# Altium schematic sheet MCU.SchDoc
size A
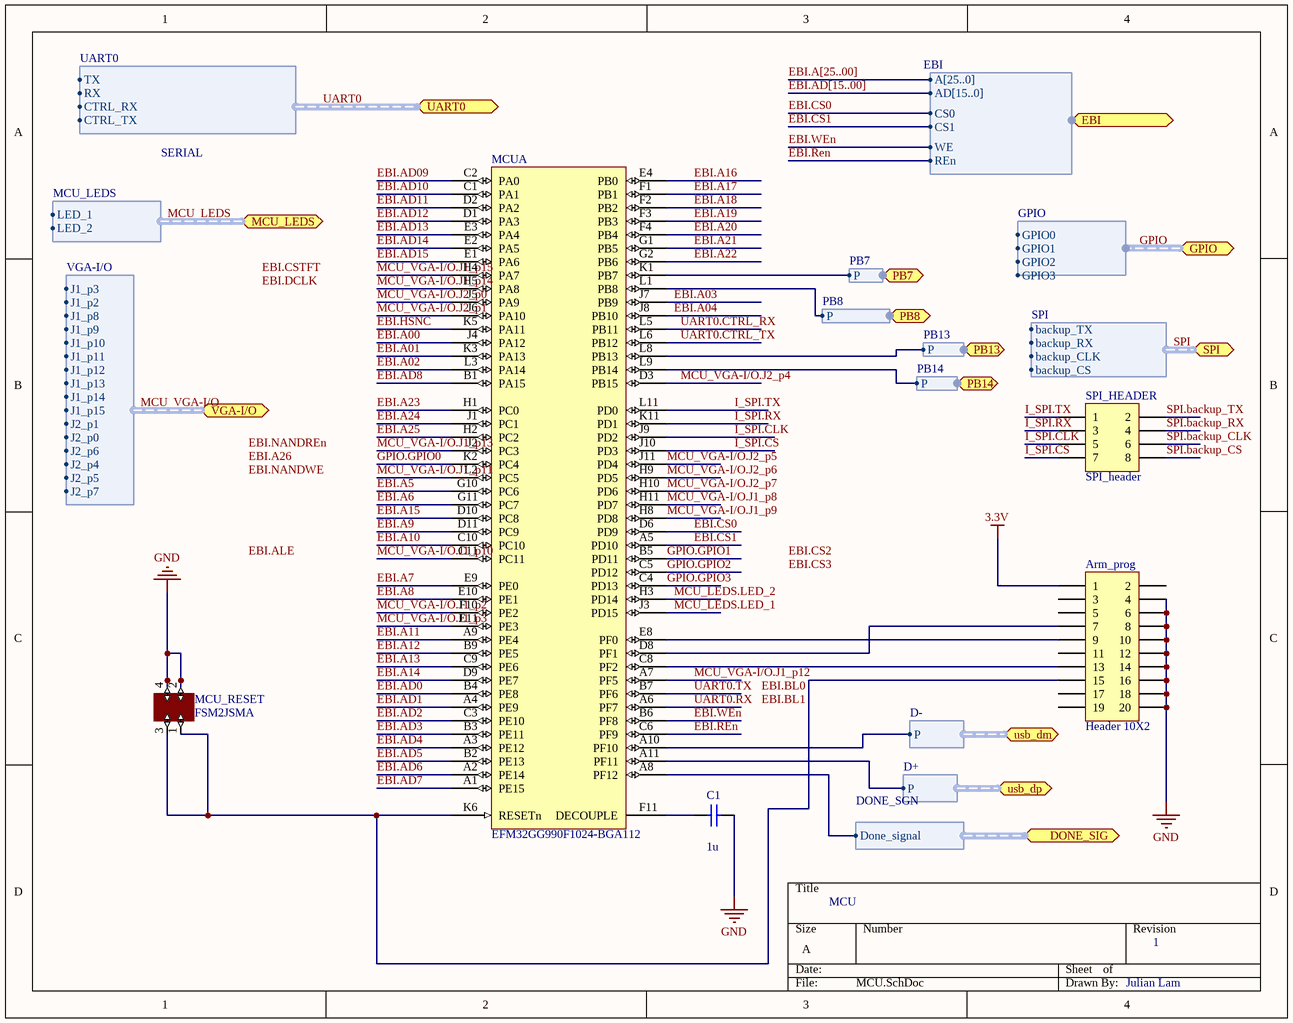
[diagram p0: MCU.SchDoc]

## Parts
Arm_prog  Header 10X2  [HDR2X10]
C1  value 1u  [C1206]
MCU  EFM32GG990F1024-BGA112  [ENMR-BGA112]  (part A of 2)
MCU_RESET  FSM2JSMA  [Button]
SPI_HEADER  SPI_header  [HDR2X4]

## Ports
DONE_SIG (harness DONE_SGN), EBI (harness EBI), GPIO (harness GPIO), MCU_LEDS (harness MCU_LEDS), PB7 (harness PB7), PB8 (harness PB8), PB13 (harness PB13), PB14 (harness PB14), SPI (harness SPI), UART0 (harness UART0), usb_dm (harness D-), usb_dp (harness D+), VGA-I/O (harness VGA-I/O)

## Harnesses
D-: P
D+: P
EBI: AD[15..0], A[25..0], CS0, WE, REn, CS1
PB7: P
PB8: P
PB13: P
PB14: P
SPI: backup_TX, backup_RX, backup_CLK, backup_CS
UART0: TX, RX, CTRL_RX, CTRL_TX
DONE_SGN: Done_signal
MCU_LEDS: LED_1, LED_2
VGA-I/O: J2_p7, J2_p5, J2_p4, J2_p6, J2_p0, J2_p1, J1_p15, J1_p14, J1_p13, J1_p12, J1_p11, J1_p10, J1_p9, J1_p8, J1_p2, J1_p3
GPIO: GPIO0, GPIO1, GPIO2, GPIO3

## Nets
3.3V: Arm_prog.1
GND: Arm_prog.4 Arm_prog.6 Arm_prog.8 Arm_prog.10 Arm_prog.12 Arm_prog.14 Arm_prog.16 Arm_prog.18 Arm_prog.20 C1.2 MCU_RESET.2 MCU_RESET.4
EBI.A00: MCU.J4(PA12)
EBI.A01: MCU.K3(PA13)
EBI.A02: MCU.L3(PA14)
EBI.A03: MCU.J7(PB9)
EBI.A04: MCU.J8(PB10)
EBI.A5: MCU.G10(PC6)
EBI.A6: MCU.G11(PC7)
EBI.A7: MCU.E9(PE0)
EBI.A8: MCU.E10(PE1)
EBI.A9: MCU.D11(PC9)
EBI.A10: MCU.C10(PC10)
EBI.A11: MCU.A9(PE4)
EBI.A12: MCU.B9(PE5)
EBI.A13: MCU.C9(PE6)
EBI.A14: MCU.D9(PE7)
EBI.A15: MCU.D10(PC8)
EBI.A16: MCU.E4(PB0)
EBI.A17: MCU.F1(PB1)
EBI.A18: MCU.F2(PB2)
EBI.A19: MCU.F3(PB3)
EBI.A20: MCU.F4(PB4)
EBI.A21: MCU.G1(PB5)
EBI.A22: MCU.G2(PB6)
EBI.A23: MCU.H1(PC0)
EBI.A24: MCU.J1(PC1)
EBI.A25: MCU.H2(PC2)
EBI.AD0: MCU.B4(PE8)
EBI.AD1: MCU.A4(PE9)
EBI.AD2: MCU.C3(PE10)
EBI.AD3: MCU.B3(PE11)
EBI.AD4: MCU.A3(PE12)
EBI.AD5: MCU.B2(PE13)
EBI.AD6: MCU.A2(PE14)
EBI.AD7: MCU.A1(PE15)
EBI.AD8: MCU.B1(PA15)
EBI.AD09: MCU.C2(PA0)
EBI.AD10: MCU.C1(PA1)
EBI.AD11: MCU.D2(PA2)
EBI.AD12: MCU.D1(PA3)
EBI.AD13: MCU.E3(PA4)
EBI.AD14: MCU.E2(PA5)
EBI.AD15: MCU.E1(PA6)
EBI.CS0: MCU.D6(PD9) ; port EBI.CS0
EBI.CS1: MCU.A5(PD10) ; port EBI.CS1
EBI.HSNC: MCU.K5(PA11)
EBI.REn: MCU.C6(PF9) ; port EBI.REn
EBI.WEn: MCU.B6(PF8) ; port EBI.WE
GPIO.GPIO0: MCU.K2(PC4)
GPIO.GPIO1: MCU.B5(PD11)
GPIO.GPIO2: MCU.C5(PD12)
GPIO.GPIO3: MCU.C4(PD13)
I_SPI.CLK: MCU.J9(PD2) SPI_HEADER.5
I_SPI.CS: MCU.J10(PD3) SPI_HEADER.7
I_SPI.RX: MCU.K11(PD1) SPI_HEADER.3
I_SPI.TX: MCU.L11(PD0) SPI_HEADER.1
MCU_LEDS.LED_1: MCU.J3(PD15)
MCU_LEDS.LED_2: MCU.H3(PD14)
MCU_VGA-I/O.J1_p2: MCU.F10(PE2)
MCU_VGA-I/O.J1_p3: MCU.E11(PE3)
MCU_VGA-I/O.J1_p8: MCU.H11(PD7)
MCU_VGA-I/O.J1_p9: MCU.H8(PD8)
MCU_VGA-I/O.J1_p10: MCU.C11(PC11)
MCU_VGA-I/O.J1_p11: MCU.L2(PC5)
MCU_VGA-I/O.J1_p12: MCU.A7(PF5)
MCU_VGA-I/O.J1_p13: MCU.J2(PC3)
MCU_VGA-I/O.J1_p14: MCU.H5(PA8)
MCU_VGA-I/O.J1_p15: MCU.H4(PA7)
MCU_VGA-I/O.J2_p0: MCU.J5(PA9)
MCU_VGA-I/O.J2_p1: MCU.J6(PA10)
MCU_VGA-I/O.J2_p4: MCU.D3(PB15)
MCU_VGA-I/O.J2_p5: MCU.J11(PD4)
MCU_VGA-I/O.J2_p6: MCU.H9(PD5)
MCU_VGA-I/O.J2_p7: MCU.H10(PD6)
SPI.backup_CLK: SPI_HEADER.6
SPI.backup_CS: SPI_HEADER.8
SPI.backup_RX: SPI_HEADER.4
SPI.backup_TX: SPI_HEADER.2
UART0.CTRL_RX: MCU.L5(PB11)
UART0.CTRL_TX: MCU.L6(PB12)
UART0.RX: MCU.A6(PF7)
UART0.TX: MCU.B7(PF6)
NetArm_prog_7: Arm_prog.7 MCU.D8(PF1)
NetArm_prog_9: Arm_prog.9 MCU.E8(PF0)
NetArm_prog_13: Arm_prog.13 MCU.C8(PF2)
NetArm_prog_15: Arm_prog.15 MCU.K6(RESETn) MCU_RESET.1 MCU_RESET.3
NetC1_1: C1.1 MCU.F11(DECOUPLE)
NetMCU_A8: MCU.A8(PF12) ; port DONE_SIG.Done_signal
NetMCU_A10: MCU.A10(PF10) ; port usb_dm.P
NetMCU_A11: MCU.A11(PF11) ; port usb_dp.P
NetMCU_K1: MCU.K1(PB7) ; port PB7.P
NetMCU_L1: MCU.L1(PB8) ; port PB8.P
NetMCU_L8: MCU.L8(PB13) ; port PB13.P
NetMCU_L9: MCU.L9(PB14) ; port PB14.P

Not connected (* = marked no-connect by the designer): Arm_prog 2 3 5 11 17 19

## Buses and harness runs
bus EBI.A[25..00]
bus EBI.AD[15..00]
harness GPIO = port GPIO
harness MCU_LEDS = port MCU_LEDS
harness MCU_VGA-I/O = port VGA-I/O
harness SPI = port SPI
harness UART0 = port UART0

## Notes on the sheet
- SERIAL
- MCU
- 1
- Julian Lam
- Labels drawn without touching a wire or pin: EBI.A26, EBI.ALE, EBI.BL0, EBI.BL1, EBI.CS2, EBI.CS3, EBI.CSTFT, EBI.DCLK, EBI.NANDREn, EBI.NANDWE

## Library data of the parts
Arm_prog = Header 10X2: Header, 10-Pin, Dual row; LatestRevisionDate: 17-Jul-2002; LatestRevisionNote: Re-released for DXP Platform.; Publisher: Altium Limited
C1 = Cap Semi: Capacitor (Semiconductor SIM Model); Published: 8-Jun-2000; LatestRevisionDate: 29-May-2009; LatestRevisionNote: IPC-7351 Footprint Added.; PackageReference: C1206; Publisher: Altium Limited; PackageDescription: Chip Capacitor
MCU = CMP-0270-00024-1: EFM32 Giant Gecko, M3 ARM Cortex CPU, 1024 KB Flash, 128 KB RAM, 1.85 - 3.8 V Supply, 48 MHz Max Speed, -40 to 85 degC, 112-Pin BGA, RoHS Compliant; LESENSE: Y; RAM (KB): 128; Flash (KB): 1024; LCD: 8x34; OPAMPS: 3; GPIO: 87; Max Speed (MHz): 48; ARM Cortex CPU: M3; DatasheetVersion: Rev 1.00; PartNumber: EFM32GG990F1024-BGA112; ComponentLink3Description: Package Specification; Subcategory: EFM32 Giant Gecko; PackageReference: BGA112; ComponentLink3URL: http://cdn.energymicro.com/dl/devices/pdf/d0007_efm32g290_datasheet.pdf; ComponentLink2Description: Datasheet; USB: Y; PackageDescription: 112-Pin Ball Grid Array, Body 10 x 10 mm, Pitch 0.8 mm; PackageVersion: Rev. 97SPP01315A_X03_06Jun11; ComponentLink1Description: Manufacturer URL; Supply Voltage (V): 1.85 - 3.8; Mounting Technology: Surface Mount; ComponentLink1URL: http://www.energymicro.com/; Generic Part Number: EFM32GG990; ComponentLink2URL: http://cdn.energymicro.com/dl/devices/pdf/d0046_efm32gg990_datasheet.pdf
MCU_RESET = switch-button: Reset button
SPI_HEADER = Header 4X2: Header, 4-Pin, Dual row; LatestRevisionDate: 17-Jul-2002; LatestRevisionNote: Re-released for DXP Platform.; Publisher: Altium Limited